# Altium schematic sheet 24V_to_4V2_regulator.SchDoc
size A4
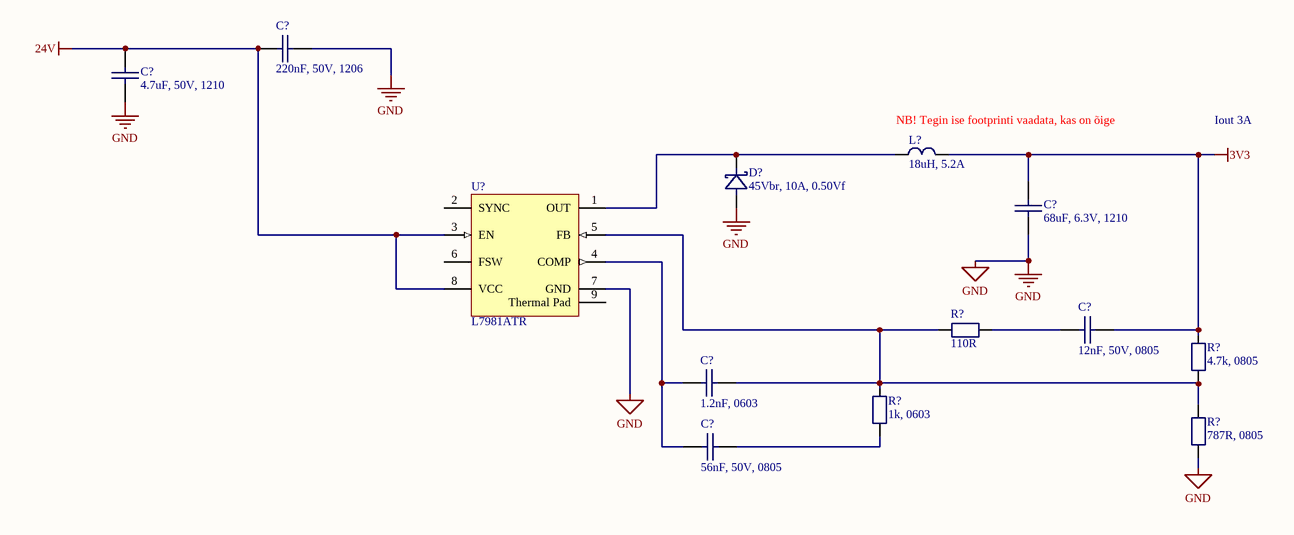
[diagram p0: 24V_to_4V2_regulator.SchDoc]

## Parts
(Parts that share a designator on the sheet are numbered #1, #2 ... from top to bottom, then left to right.)
C?#1  220nF, 50V, 1206  [3216 [1206] CAP]
C?#2  4.7uF, 50V, 1210  [3225 [1210] CAP]
C?#3  68uF, 6.3V, 1210  [3225 [1210] CAP]
C?#4  12nF, 50V, 0805  [2012 [0805] CAP]
C?#5  1.2nF, 0603  [1608 [0603] CAP]
C?#6  56nF, 50V, 0805  [2012 [0805] CAP]
D?  45Vbr, 10A, 0.50Vf  [DPAK (TO252-3)]
L?  18uH, 5.2A  [12.5 x 12.5 x 8.5 (mm)]
R?#1  110R  [2012 [0805] RES]
R?#2  4.7k, 0805  [2012 [0805] RES]
R?#3  1k, 0603  [1608 [0603] RES]
R?#4  787R, 0805  [2012 [0805] RES]
U?  L7981ATR  [HSOP8-D1_N]

## Nets
3V3: C?#3.1 C?#4.1 L?.2 R?#2.2
24V: C?#1.2 C?#2.1 U?.3(EN) U?.8(VCC)
GND: C?#1.1 C?#2.2 C?#3.2 D?.2 R?#4.1 U?.7(GND)
NetC?#4_2: C?#4.2 R?#1.2
NetC?#5_1: C?#5.1 R?#1.1 R?#2.1 R?#3.2 R?#4.2 U?.5(FB)
NetC?#5_2: C?#5.2 C?#6.2 U?.4(COMP)
NetC?#6_1: C?#6.1 R?#3.1
NetD?_1: D?.1 L?.1 U?.1(OUT)

Not connected (* = marked no-connect by the designer): U? 2(SYNC) 6(FSW) 9(Thermal_Pad)

## Notes on the sheet
- (near L?) NB! Tegin ise footprinti vaadata, kas on õige
- Iout 3A

## Library data of the parts
C?#1 = Capacitor: Product Name: CM316X7R224K50AT; Manufacturer: *; Supplier Number: 1216553; Supplier: Farnell; Notes: *
C?#2 = Capacitor: Product Name: GRM32ER71H475KA88L; Manufacturer: *; Supplier Number: 1828841; Supplier: Farnell; Notes: *
C?#3 = Capacitor: Product Name: C3225X5R0J686M200AC; Manufacturer: *; Supplier Number: 2526283; Supplier: Farnell; Notes: *
C?#4 = Capacitor: Product Name: GRM2195C1H123JA01D; Manufacturer: *; Supplier Number: *; Supplier: Mouser; Notes: *
C?#5 = Capacitor: Product Name: 06035A122JAT2A; Manufacturer: *; Supplier Number: *; Supplier: Mouser; Notes: *
C?#6 = Capacitor: Product Name: MC0805B563K500CT; Manufacturer: *; Supplier Number: 1759261; Supplier: Farnell; Notes: *
D? = Diode Shottky: pin to pad: 1>2 2>3; Product Name: STPS1045B; Manufacturer: *; Supplier Number: 9907297; Supplier: Farnell; Notes: *
L? = Inductor: Product Name: 744770118; Manufacturer: *; Supplier Number: 2082594; Supplier: Farnell; Notes: *
R?#1-R?#4 = Resistor: Manufacturer: *; Product Name: *; Supplier Number: *; Supplier: Farnell; Notes: *
U? = L7981ATR: 3 A step-down switching regulator, 8-Pin HSOP, Tape and Reel; DatasheetVersion: Jul-2010; PackageVersion: 2010; PackageReference: HSOP8-D1; PackageDescription: 8-Pin Small Outline Integrated Circuit 1.27 mm Pitch; ComponentLink1Description: Manufacturer URL; ComponentLink1URL: http://www.st.com; ComponentLink2Description: Datasheet; ComponentLink2URL: http://www.st.com/internet/com/TECHNICAL_RESOURCES/TECHNICAL_LITERATURE/DATASHEET/CD00217474.pdf